# EAGLE design DCCGen_ATMEGA_V2_Haka (EAGLE 5.11)
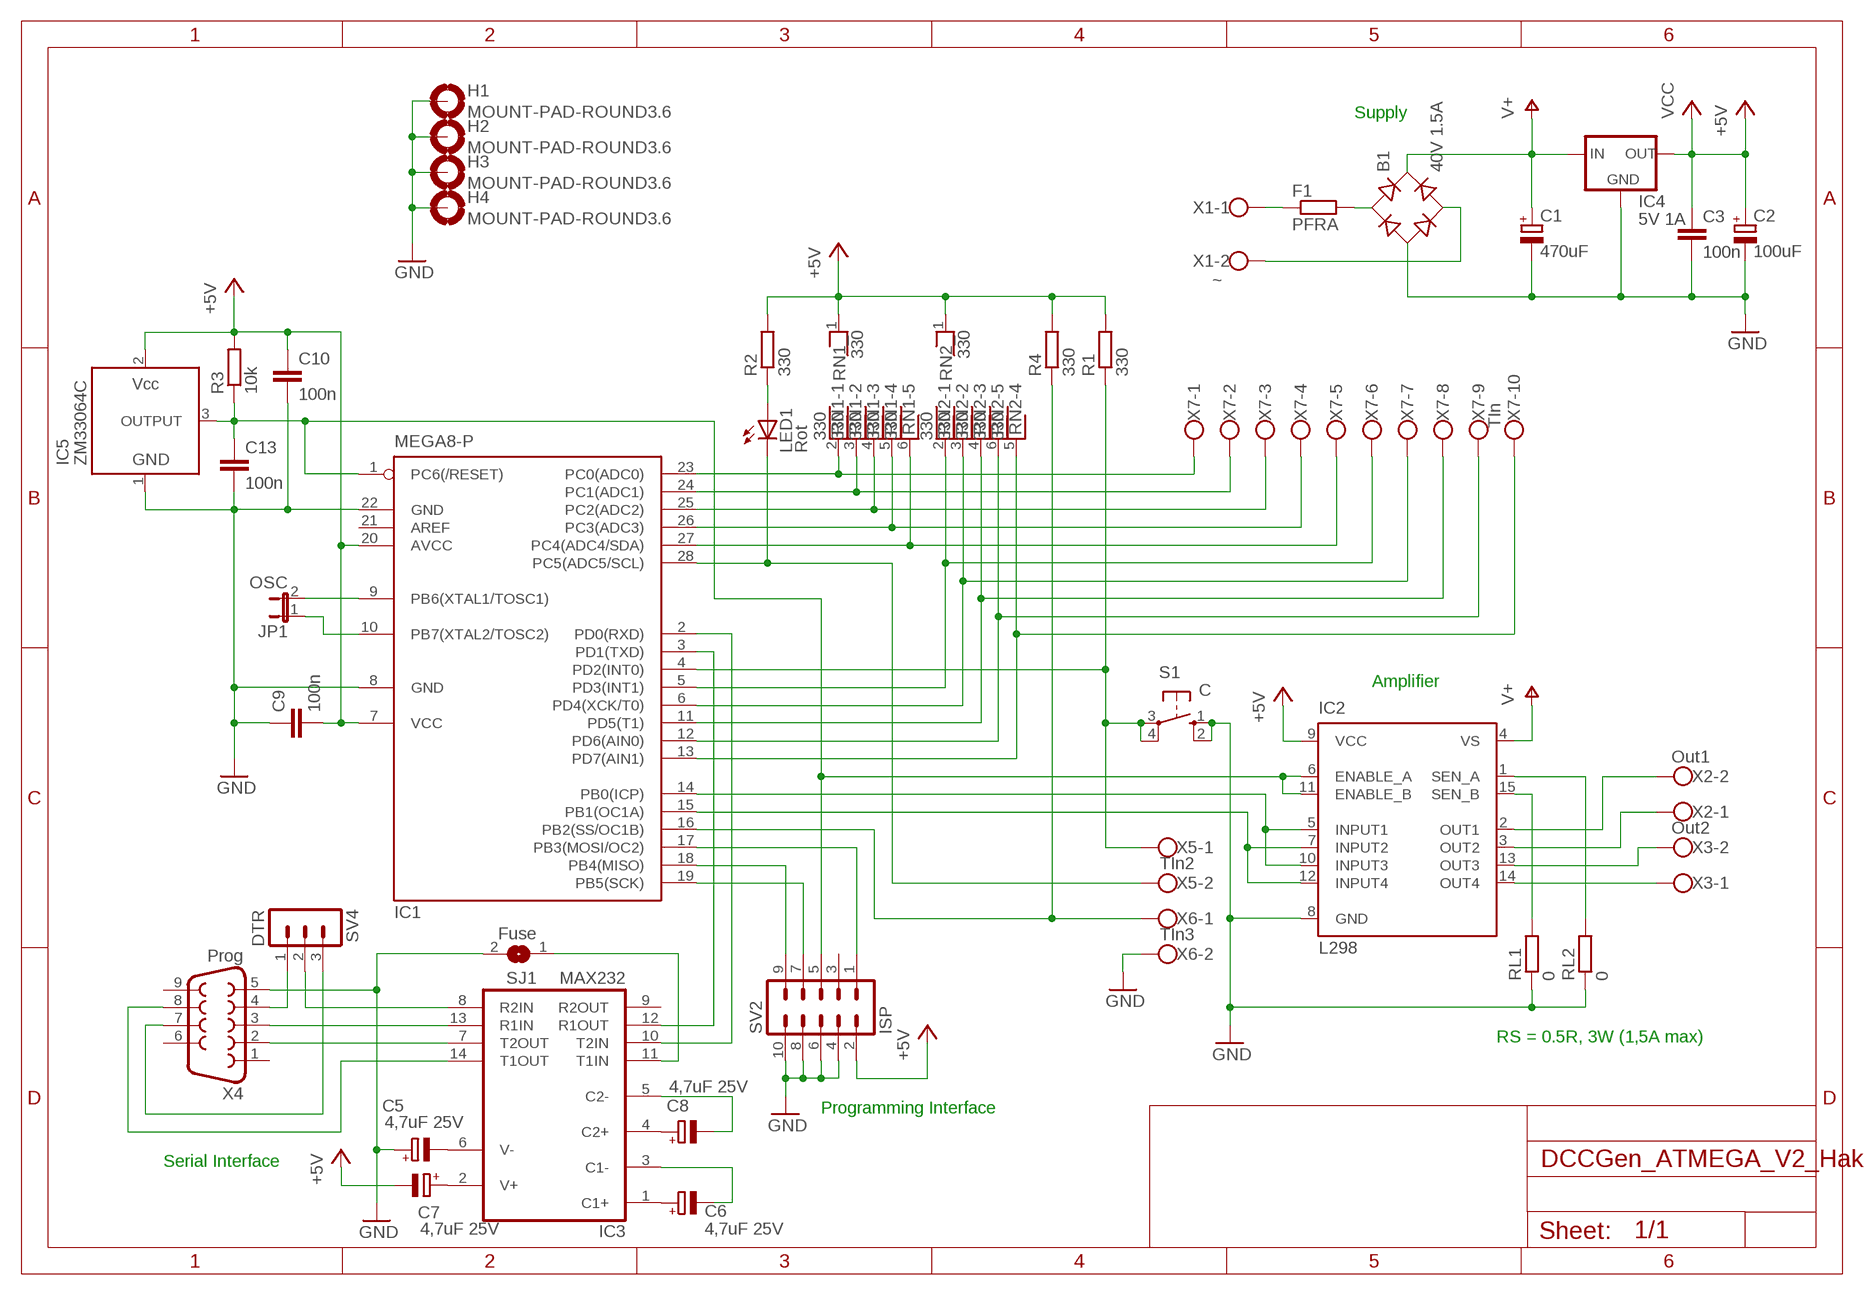
[diagram p0: schematic, sheet 1]

## Parts
B1  40V 1.5A  RB1A  [RB1A]
C1  470uF  CPOL-EUE3.5-10  [E3,5-10]
C2  100uF  CPOL-EUE2-5  [E2-5]
C3  100n  C-EU025-025X050  [C025-025X050]
C5  4,7uF 25V  CPOL-EUE2,5-6E  [E2,5-6E]
C6  4,7uF 25V  CPOL-EUE2,5-6E  [E2,5-6E]
C7  4,7uF 25V  CPOL-EUE2,5-6E  [E2,5-6E]
C8  4,7uF 25V  CPOL-EUE2,5-6E  [E2,5-6E]
C9  100n  C-EU025-025X050  [C025-025X050]
C10  100n  C-EU025-025X050  [C025-025X050]
C13  100n  C-EU025-025X050  [C025-025X050]
F1  PFRA  R-EU_0204/5  [0204/5]
H1  MOUNT-PAD-ROUND3.6  [3,6-PAD]
H2  MOUNT-PAD-ROUND3.6  [3,6-PAD]
H3  MOUNT-PAD-ROUND3.6  [3,6-PAD]
H4  MOUNT-PAD-ROUND3.6  [3,6-PAD]
IC1  MEGA8-P  [DIL28-3]
IC2  L298  [MULTIWATT-15]
IC3  MAX232  [DIL16]
IC4  5V 1A  78XXS  [78XXS]
IC5  ZM33064C  [TO92]
JP1  OSC  JP1E  [JP1]
LED1  Rot  LED3MM  [LED3MM]
R1  330  R-EU_0207/10  [0207/10]
R2  330  R-EU_0207/10  [0207/10]
R3  10k  R-EU_0207/10  [0207/10]
R4  330  R-EU_0207/10  [0207/10]
RL1  0  R-EU_0207/10  [0207/10]
RL2  0  R-EU_0207/10  [0207/10]
RN1  330  RNX5  [RN-6]
RN2  330  RNX5  [RN-6]
S1  C  10-XX  [B3F-10XX]
SJ1  Fuse  SJ  [SJ]
SV2  ISP  MA05-2  [MA05-2]
SV4  DTR  MA03-1  [MA03-1]
X1  ~  W237-02P  [W237-132]
X2  Out1  W237-02P  [W237-132]
X3  Out2  W237-02P  [W237-132]
X4  Prog  F09HP  [F09HP]
X5  TIn2  W237-02P  [W237-132]
X6  TIn3  W237-02P  [W237-132]
X7  TIn  W237-10P  [W237-10P]

## Nets
+5V: C2.+ C3.1 C7.- C9.2 C10.1 IC1.7(VCC) IC1.20(AVCC) IC2.9(VCC) IC4.OUT IC5.2(VCC) R1.2 R2.2 R3.2 R4.2 RN1.1 RN2.1 SV2.2 ; supply symbol labelled VCC
GND: B1.- C1.- C2.- C3.2 C5.+ C9.1 C10.2 C13.2 H1.B3,6(MOUNT) H2.B3,6(MOUNT) H3.B3,6(MOUNT) H4.B3,6(MOUNT) IC1.8(GND) IC1.22(GND) IC2.8(GND) IC4.GND IC5.1(GND) RL1.1 RL2.1 S1.1(S) S1.2(S1) SJ1.2 SV2.4 SV2.6 SV2.8 SV2.10 X4.5 X6.2
N$1: F1.1 X1.1
N$2: B1.AC2 X1.2
N$3: IC1.13(PD7(AIN1)) RN2.5 X7.10
N$4: IC1.12(PD6(AIN0)) RN2.6 X7.9
N$5: IC1.23(PC0(ADC0)) RN1.2 X7.1
N$6: IC1.17(PB3(MOSI/OC2)) SV2.1
N$7: IC1.19(PB5(SCK)) SV2.7
N$8: IC1.18(PB4(MISO)) SV2.9
N$9: C13.1 IC1.1(PC6(/RESET)) IC2.6(ENABLE_A) IC2.11(ENABLE_B) IC5.3(OUTPUT) R3.1 SV2.5
N$10: IC1.24(PC1(ADC1)) RN1.3 X7.2
N$11: IC1.25(PC2(ADC2)) RN1.4 X7.3
N$12: IC1.26(PC3(ADC3)) RN1.5 X7.4
N$13: IC1.27(PC4(ADC4/SDA)) RN1.6 X7.5
N$14: IC1.5(PD3(INT1)) RN2.2 X7.6
N$15: IC1.9(PB6(XTAL1/TOSC1)) JP1.2
N$16: IC1.10(PB7(XTAL2/TOSC2)) JP1.1
N$17: LED1.A R2.1
N$19: IC1.6(PD4(XCK/T0)) RN2.3 X7.7
N$20: IC1.4(PD2(INT0)) R1.1 S1.3(P) S1.4(P1) X5.1
N$21: IC3.8(R2IN) SV4.2
N$22: IC2.14(OUT4) X3.1
N$23: IC1.28(PC5(ADC5/SCL)) LED1.K(C) X5.2
N$24: IC2.1(SEN_A) RL2.2
N$25: IC2.13(OUT3) X3.2
N$26: IC2.15(SEN_B) RL1.2
N$27: IC1.14(PB0(ICP)) IC2.5(INPUT1) IC2.10(INPUT3)
N$28: IC1.15(PB1(OC1A)) IC2.7(INPUT2) IC2.12(INPUT4)
N$29: IC2.3(OUT2) X2.1
N$30: IC2.2(OUT1) X2.2
N$31: IC1.2(PD0(RXD)) IC3.10(T2IN)
N$32: IC1.3(PD1(TXD)) IC3.12(R1OUT)
N$33: C5.- IC3.6(V-)
N$34: C7.+ IC3.2(V+)
N$35: IC3.7(T2OUT) X4.2
N$36: C6.+ IC3.1(C1+)
N$37: C6.- IC3.3(C1-)
N$38: C8.+ IC3.4(C2+)
N$39: C8.- IC3.5(C2-)
N$40: IC3.13(R1IN) X4.3
N$41: IC3.14(T1OUT) X4.8
N$42: SV4.1 X4.4
N$43: B1.AC1 F1.2
N$44: SV4.3 X4.7
N$45: IC1.16(PB2(SS/OC1B)) R4.1 X6.1
N$46: IC3.11(T1IN) SJ1.1
N$47: IC1.11(PD5(T1)) RN2.4 X7.8
V+: B1.+ C1.+ IC2.4(VS) IC4.IN
Unconnected: IC1.21(AREF) IC3.9(R2OUT) SV2.3 X4.1 X4.6 X4.9

## Notes on the sheet
- Supply
- Amplifier
- RS = 0.5R, 3W (1,5A max)
- Programming Interface
- Serial Interface

## Power pins joined to a net without a drawn wire
+5V: IC3.16(VCC)
GND: IC3.15(GND)

## Library data of the parts
B1 = rectifier:RB1A: RECTIFIER 1 A
C1 C2 C5-C8 = rcl:CPOL-EU: POLARIZED CAPACITOR, European symbol
C3 C9 C10 C13 = rcl:C-EU: CAPACITOR, European symbol
F1 R1-R4 RL1 RL2 = rcl:R-EU_: RESISTOR, European symbol
H1-H4 = holes:MOUNT-PAD-ROUND: MOUNTING PAD, round
IC1 = atmel:MEGA8-P: MICROCONTROLLER 8 Kbytes FLASH, 1 kbytes SRAM, 512 bytes EEPROM, USART, 4-channel 10 bit ADC, 2-channel 8 bit ADC Pin compatible with Atmega48, ATMega88, ATMega168 Source: avr.lbr
IC2 = st-microelectronics:L298: DUAL FULL-BRIDGE DRIVER
IC3 = maxim:MAX232: RS232 TRANSEIVER
IC4 = v-reg:78XXS: VOLTAGE REGULATOR
IC5 = andereBauteile:ZM33064: ZM33064 Resetbautstein Schaltschwelle bei 4,6 Volt
JP1 = jumper:JP1E: JUMPER
LED1 = led:LED: LED OSRAM: - CHIPLED LG R971, LG N971, LY N971, LG Q971, LY Q971, LO R971, LY R971 LH N974, LH R974 LS Q976, LO Q976, LY Q976 LO Q996 - Hyper CHIPLED LW Q18S LB Q993, LB Q99A, LB R99A - SideLED LS A670, LO A670, LY A670, LG A670, LP A670 LB A673, LV A673, LT A673, LW A673 LH A674 LY A675 LS A676, LA A676, LO A676, LY A676, LW A676 LS A679, LY A679, LG A679 - Hyper Micro SIDELED® LS Y876, LA Y876, LO Y876, LY Y876 LT Y87S - SmartLED LW L88C, LW L88S LB L89C, LB L89S, LG L890 LS L89K, LO L89K, LY L89K LS L896, LA L896, LO L896, LY L896 - TOPLED LS T670, LO T670, LY T670, LG T670, LP T670 LSG T670, LSP T670, LSY T670, LOP T670, LYG T670 LG T671, LOG T671, LSG T671 LB T673, LV T673, LT T673, LW T673 LH T674 LS T676, LA T676, LO T676, LY T676, LB T676, LH T676, LSB T676, LW T676 LB T67C, LV T67C, LT T67C, LS T67K, LO T67K, LY T67K, LW E67C LS E67B, LA E67B, LO E67B, LY E67B, LB E67C, LV E67C, LT E67C LW T67C LS T679, LY T679, LG T679 LS T770, LO T770, LY T770, LG T770, LP T770 LB T773, LV T773, LT T773, LW T773 LH T774 LS E675, LA E675, LY E675, LS T675 LS T776, LA T776, LO T776, LY T776, LB T776 LHGB T686 LT T68C, LB T68C - Hyper Mini TOPLED® LB M676 - Mini TOPLED Santana® LG M470 LS M47K, LO M47K, LY M47K Source: http://www.osram.convergy.de LUXEON: - LUMILED® LXK2-PW12-R00, LXK2-PW12-S00, LXK2-PW14-U00, LXK2-PW14-V00 LXK2-PM12-R00, LXK2-PM12-S00, LXK2-PM14-U00 LXK2-PE12-Q00, LXK2-PE12-R00, LXK2-PE12-S00, LXK2-PE14-T00, LXK2-PE14-U00 LXK2-PB12-K00, LXK2-PB12-L00, LXK2-PB12-M00, LXK2-PB14-N00, LXK2-PB14-P00, LXK2-PB14-Q00 LXK2-PR12-L00, LXK2-PR12-M00, LXK2-PR14-Q00, LXK2-PR14-R00 LXK2-PD12-Q00, LXK2-PD12-R00, LXK2-PD12-S00 LXK2-PH12-R00, LXK2-PH12-S00 LXK2-PL12-P00, LXK2-PL12-Q00, LXK2-PL12-R00 Source: www.luxeon.com KINGBRIGHT: KA-3528ASYC Source: www.kingbright.com
RN1 RN2 = resistor-net:RNX5: RESISTOR NETWORK
S1 = switch-omron:10-XX: OMRON SWITCH
SJ1 = jumper:SJ: SMD solder JUMPER
SV2 = con-lstb:MA05-2: PIN HEADER
SV4 = con-lstb:MA03-1: PIN HEADER
X1-X3 X5 X6 = con-wago-508:W237-02P: WAGO SREW CLAMP
X4 = con-subd:F09: SUB-D; OC_FARNELL: unknown; OC_NEWARK: unknown
X7 = con-wago-508:W237-10P: WAGO SREW CLAMP

## Board
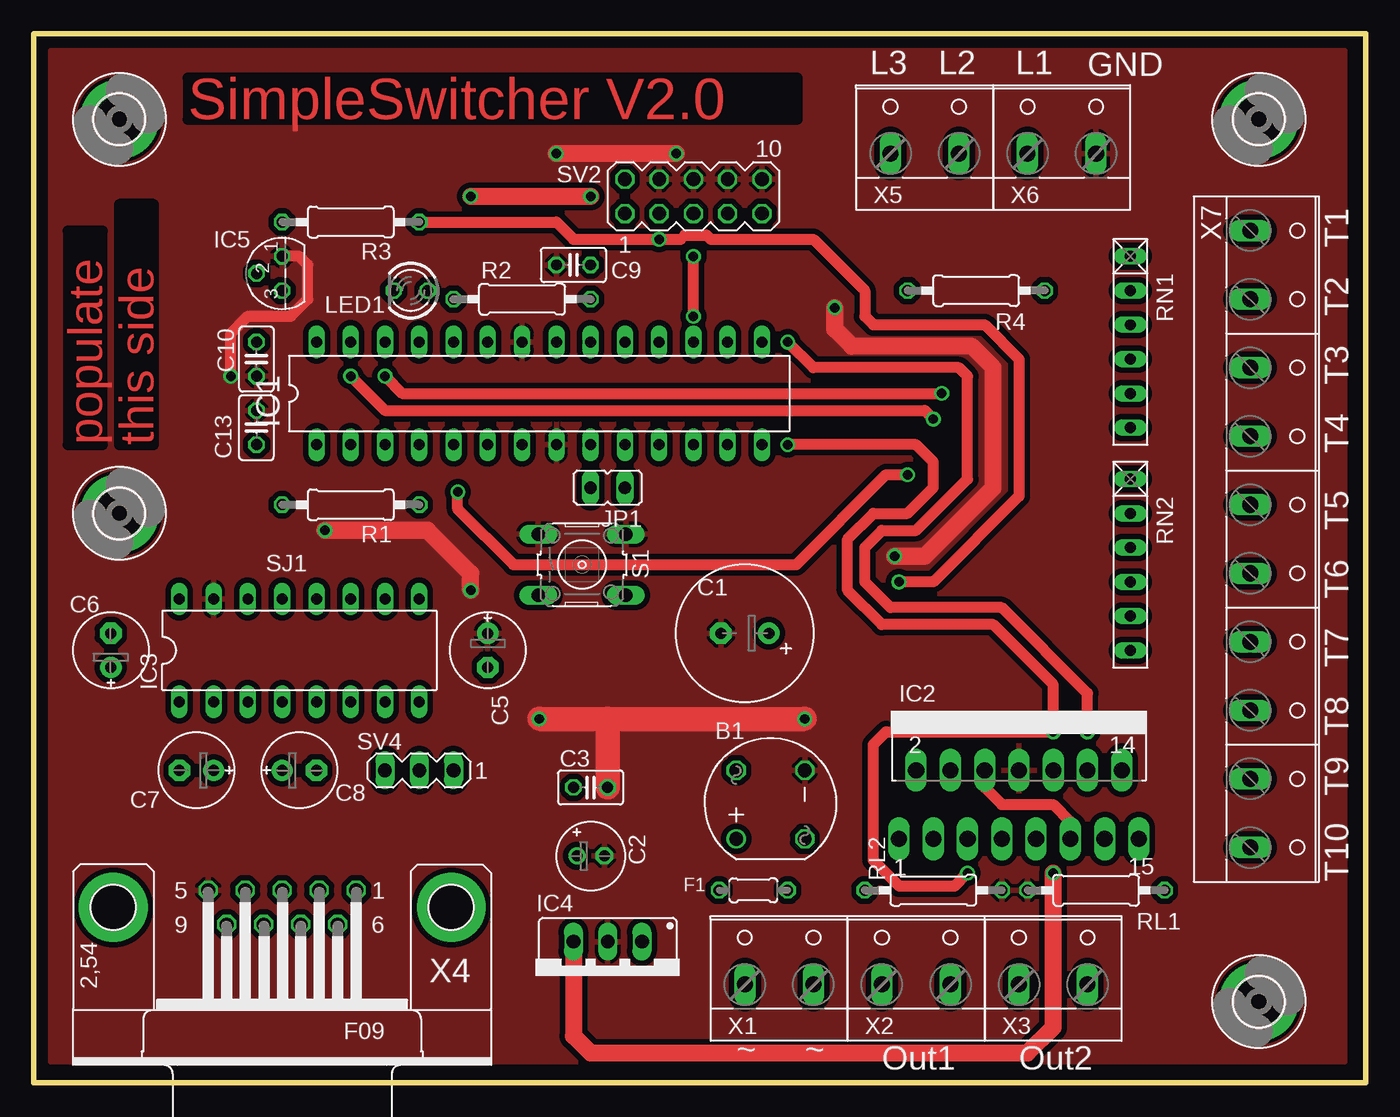
[diagram p1: board, top side]
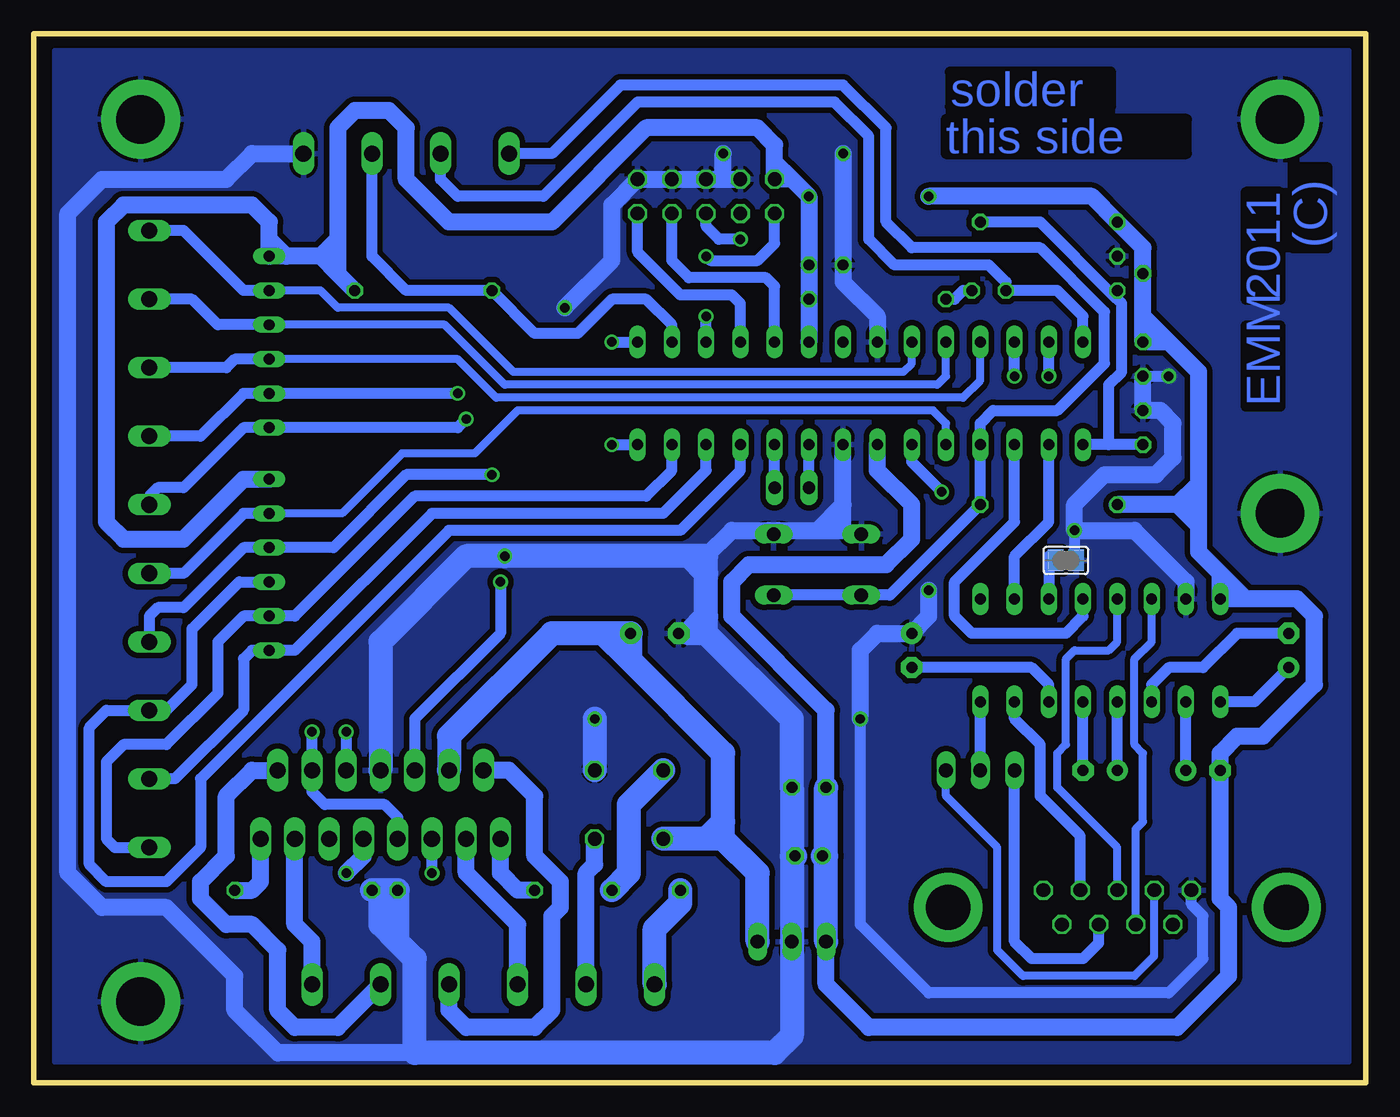
[diagram p2: board, bottom side, seen from below]

Size 98.73 x 77.78 mm. Coordinates in mm from the lower left corner, seen from the top.
Outline: 0,0 98.73,0 98.73,77.78 0,77.78 0,0
Copper layers (1*16): Top 0.035mm / dielectric 1.5mm / Bottom 0.035mm
Design rules "HAKA LP ZWILLING": minimum track width 0.2mm, minimum drill 0.5mm, track to track 0.2mm, track to pad 0.2mm, pad to pad 0.15mm, via to via 0.2mm, smd to smd 0mil, copper to edge 0.2mm, drill to drill 0.2mm, minimum pad ring 0.2mm, minimum via ring 0.2mm, stop-mask expansion 0.1mm, vias tented up to drill 0mil, thermal gap 10mil

### Footprints (pad centres in the part's own frame; a part is rotated, then mirrored left to right if it is on the bottom)
RB1A = drill 1.016 round: + -2.54,2.54 | drill 1.016 octagon: - 2.54,-2.54; AC1 2.54,2.54; AC2 -2.54,-2.54
E3,5-10 = drill 0.813 pad 1.6 round: + -1.778,0 | drill 0.813 pad 1.6 octagon: - 1.778,0
E2-5 = drill 0.813 pad 1.27 round: + -1.016,0 | drill 0.813 pad 1.27 octagon: - 1.016,0
C025-025X050 = drill 0.813 octagon: 1 -1.27,0; 2 1.27,0
E2,5-6E = drill 0.813 pad 1.575 round: + -1.27,0 | drill 0.813 pad 1.575 octagon: - 1.27,0
0204/5 = drill 0.813 octagon: 1 -2.54,0; 2 2.54,0
3,6-PAD = drill 3.6 pad 5.842 round: B3,6 0,0
DIL28-3 = drill 0.813 long: 1 -16.51,-3.81; 2 -13.97,-3.81; 3 -11.43,-3.81; 4 -8.89,-3.81; 5 -6.35,-3.81; 6 -3.81,-3.81; 7 -1.27,-3.81; 8 1.27,-3.81; 9 3.81,-3.81; 10 6.35,-3.81; 11 8.89,-3.81; 12 11.43,-3.81; 13 13.97,-3.81; 14 16.51,-3.81; 15 16.51,3.81; 16 13.97,3.81; 17 11.43,3.81; 18 8.89,3.81; 19 6.35,3.81; 20 3.81,3.81; 21 1.27,3.81; 22 -1.27,3.81; 23 -3.81,3.81; 24 -6.35,3.81; 25 -8.89,3.81; 26 -11.43,3.81; 27 -13.97,3.81; 28 -16.51,3.81
MULTIWATT-15 = drill 1.2 long: 1 -8.89,-7.62; 2 -7.62,-2.54; 3 -6.35,-7.62; 4 -5.08,-2.54; 5 -3.81,-7.62; 6 -2.54,-2.54; 7 -1.27,-7.62; 8 0,-2.54; 9 1.27,-7.62; 10 2.54,-2.54; 11 3.81,-7.62; 12 5.08,-2.54; 13 6.35,-7.62; 14 7.62,-2.54; 15 8.89,-7.62
DIL16 = drill 0.813 long: 1 -8.89,-3.81; 2 -6.35,-3.81; 3 -3.81,-3.81; 4 -1.27,-3.81; 5 1.27,-3.81; 6 3.81,-3.81; 7 6.35,-3.81; 8 8.89,-3.81; 9 8.89,3.81; 10 6.35,3.81; 11 3.81,3.81; 12 1.27,3.81; 13 -1.27,3.81; 14 -3.81,3.81; 15 -6.35,3.81; 16 -8.89,3.81
78XXS = drill 1.016 long: GND 0,-2.54; IN -2.54,-2.54; OUT 2.54,-2.54
TO92 = drill 0.813 octagon: 1 1.27,0; 2 0,1.905; 3 -1.27,0
JP1 = drill 0.914 long: 1 0,-1.27; 2 0,1.27
LED3MM = drill 0.813 octagon: A -1.27,0; K 1.27,0
0207/10 = drill 0.813 octagon: 1 -5.08,0; 2 5.08,0
RN-6 = drill 0.813 long: 1 -6.35,0; 2 -3.81,0; 3 -1.27,0; 4 1.27,0; 5 3.81,0; 6 6.35,0
B3F-10XX = drill 1.016 long: 1 -3.251,2.261; 2 3.251,2.261; 3 -3.251,-2.261; 4 3.251,-2.261
SJ = smd 1.168 x 1.6: 1 -0.762,0; 2 0.762,0
MA05-2 = drill 1.016 octagon: 1 -5.08,-1.27; 2 -5.08,1.27; 3 -2.54,-1.27; 4 -2.54,1.27; 5 0,-1.27; 6 0,1.27; 7 2.54,-1.27; 8 2.54,1.27; 9 5.08,-1.27; 10 5.08,1.27
MA03-1 = drill 1.016 long: 1 -2.54,0; 2 0,0; 3 2.54,0
W237-132 = drill 1.194 long: 1 -2.54,-0.635; 2 2.54,-0.635
F09HP = drill 1.016 octagon: 1 -5.486,-1.27; 2 -2.743,-1.27; 3 0,-1.27; 4 2.743,-1.27; 5 5.486,-1.27; 6 -4.115,1.27; 7 -1.372,1.27; 8 1.372,1.27; 9 4.115,1.27 | drill 3.302 pad 5.08 round: G1 -12.522,0; G2 12.522,0
W237-10P = drill 1.194 long: 1 -22.86,-0.635; 2 -17.78,-0.635; 3 -12.7,-0.635; 4 -7.62,-0.635; 5 -2.54,-0.635; 6 2.54,-0.635; 7 7.62,-0.635; 8 12.7,-0.635; 9 17.78,-0.635; 10 22.86,-0.635

### Placement (x,y rotation side)
B1  54.61,20.64 90 top
C1  52.7,33.34 180 top
C2  41.27,16.83 0 top
C3  41.27,21.91 0 top
C5  33.66,32.07 270 top
C6  5.71,32.07 90 top
C7  12.07,23.18 180 top
C8  19.68,23.18 0 top
C9  40,60.64 0 top
C10  16.51,53.66 270 top
C13  16.51,48.58 90 top
F1  53.34,14.29 0 top
H1  6.35,71.44 0 top
H2  6.35,42.23 0 top
H3  90.8,71.44 0 top
H4  90.8,6.03 0 top
IC1  37.46,51.12 0 top
IC2  73.03,25.72 0 top
IC3  19.68,32.07 0 top
IC4  42.55,7.94 180 top
IC5  18.41,60.01 90 top
JP1  42.55,44.13 90 top
LED1  27.94,58.74 180 top
R1  23.49,42.86 180 top
R2  36.2,58.1 0 top
R3  23.49,63.82 180 top
R4  69.85,58.74 0 top
RL1  78.74,14.29 0 top
RL2  66.67,14.29 180 top
RN1  81.28,54.93 270 top
RN2  81.28,38.42 270 top
S1  40.64,38.42 0 top
SJ1  22.22,38.73 0 bottom
SV2  48.89,65.72 0 top
SV4  28.57,23.18 180 top
X1  55.24,7.94 0 top
X2  65.41,7.94 0 top
X3  75.56,7.94 0 top
X4  18.41,13.02 180 top
X5  66.04,69.53 0 top
X6  76.2,69.53 0 top
X7  90.8,40.32 270 top

### Tracks (layer width: path | path; a pad name or v marks a point on that pad's centre or on a via)
+5V  (via drill 0.7)
  Top 1.27: v32.38,65.72 v41.27,65.72 | v75.56,15.56 75.56,4.13 73.66,2.22 41.27,2.22 40,3.49 IC4.OUT
  Bottom 1.27: 10.79,37.78 IC3.16 8.89,35.88 | 12.38,41.27 12.38,42.86 | 12.38,42.86 13.97,42.86 | 13.97,42.86 R1.2 | 8.89,35.88 5.08,35.88 3.81,34.61 3.81,29.53 7.62,25.72 9.53,25.72 10.79,24.45 C7.- 10.79,13.65 10.16,13.02 10.16,7.94 13.97,4.13 36.83,4.13 40,7.3 IC4.OUT | 12.38,42.86 12.38,44.45 | 14.61,54.93 C10.1 16.51,56.83 | 42.55,66.99 SV2.2 43.81,68.26 | 42.55,66.99 v41.27,65.72 C9.2 R2.2 IC1.20 | 43.81,68.26 43.81,69.53 45.09,70.8 53.34,70.8 60.32,63.82 67.94,63.82 71.12,66.99 71.12,70.8 72.39,72.07 74.93,72.07 76.2,70.8 76.2,62.55 | v32.38,65.72 20.32,65.72 R3.2 16.51,61.91 IC5.2 16.51,56.83 | IC1.7 36.2,45.4 33.66,42.86 33.66,40.32 35.56,38.42 45.72,38.42 46.99,37.15 46.99,34.61 40,27.62 C3.1 | IC2.9 74.3,16.83 v75.56,15.56 | 76.2,62.55 76.2,61.28 | 76.2,61.28 76.2,60.01 | 76.2,60.01 R4.2 | 13.97,42.86 12.38,44.45 | 12.38,41.27 13.97,42.86 | 14.61,54.93 16.51,56.83 | 12.38,44.45 12.38,52.7 14.61,54.93 | 8.89,35.88 10.79,37.78 | 12.38,41.27 12.38,39.37 10.79,37.78 | RN2.1 83.19,44.77 87.63,40.32 92.08,40.32 93.34,41.59 93.34,63.82 92.08,65.09 82.55,65.09 81.28,63.82 81.28,62.55 | 81.28,62.55 RN1.1 80.01,61.28 | 76.2,61.28 77.47,61.28 | 77.47,61.28 80.01,61.28 | 42.55,66.99 43.81,68.26 | 76.2,62.55 77.47,61.28 | 77.47,61.28 76.2,60.01 | 80.01,61.28 81.28,62.55
  Bottom 1.778: IC4.OUT 40,16.83 | 40,16.83 C3.1 | 40,16.83 C2.+
GND  (via drill 0.7)
  Top 0.813: IC5.1 19.68,61.28 20.32,60.64 20.32,58.1 19.05,56.83 15.88,56.83 14.61,55.56 v14.61,52.39
  Top 1.27: v32.38,36.51 32.38,37.78 29.21,40.96 v21.59,40.96 | v47.62,68.9 v38.73,68.9 | v63.82,39.05 66.04,39.05 71.12,44.13 71.12,53.02 69.53,54.61 60.64,54.61 59.37,55.88 v59.37,57.47
  Top 1.778: 42.55,26.99 v57.15,26.99 | v37.46,26.99 42.55,26.99 | 42.55,26.99 C3.2
  Bottom 0.813: X4.5 12.93,13.25 12.07,12.38 12.07,9.21 14.61,6.67 32.38,6.67 37.46,11.75 v37.46,26.99 | 38.73,40.96 37.67,40.96 S1.1 | 44.25,40.96 S1.2 | S1.2 43.46,40.68 | S1.2 43.54,40.96 | v21.59,40.96 21.59,39.18 SJ1.2 | C10.2 v14.61,52.39
  Bottom 1.27: 47.62,66.99 SV2.6 SV2.8 SV2.10 55.88,65.09 55.88,60.96 v59.37,57.47 | C10.2 C13.2 15.24,49.85 14.29,48.9 14.29,46.36 15.56,45.08 19.37,45.08 21.59,42.86 v21.59,40.96 17.14,40.96 13.34,37.15 IC3.15 | IC1.22 36.2,56.83 38.73,59.37 C9.1 v38.73,68.9 | 47.62,66.99 SV2.4 | 47.62,66.99 v47.62,68.9 | X6.2 82.55,68.9 84.45,66.99 93.66,66.99 96.2,64.45 96.2,15.56 93.66,13.02 88.9,13.02 83.82,7.94 83.82,5.4 80.64,2.22 70.48,2.22 | 38.73,42.86 38.73,40.96 40.64,40.96 | 38.73,42.86 IC1.8 | 40.64,40.96 43.54,40.96 44.25,40.96 46.99,40.96 48.89,39.05 | 50.16,33.34 C1.- | v32.38,36.51 32.38,34.61 C5.+ 36.2,33.34 37.46,32.07 v37.46,26.99 | 40.64,40.96 38.73,42.86
  Bottom 1.778: 73.03,14.29 RL1.1 | 73.03,14.29 73.03,11.75 71.75,10.48 | IC2.8 73.03,32.7 66.67,39.05 v63.82,39.05 50.16,39.05 | v57.15,26.99 B1.- | 48.89,33.34 50.16,33.34 48.89,34.61 | 48.89,33.34 42.55,26.99 C3.2 42.55,16.83 | 48.89,33.34 48.89,34.61 | 48.89,34.61 48.89,37.78 | 48.89,37.78 48.89,39.05 50.16,39.05 | 73.03,14.29 RL2.1 71.75,10.48 | 71.75,10.48 70.48,9.21 70.48,2.22 43.81,2.22 42.55,3.49 IC4.GND 42.55,16.83 | 48.89,37.78 50.16,39.05 | 42.55,16.83 C2.-
  pour Bottom (isolate 0.406): 1.27,76.52 97.16,76.52 97.16,1.59 1.27,1.59
  pour Top (isolate 0.406): 1.27,76.52 97.16,76.52 97.16,1.59 1.27,1.59
N$1
  Bottom 1.778: X1.1 52.7,11.43 50.8,13.33 F1.1
N$2
  Bottom 1.27: X1.2 57.78,15.56 57.15,16.19 B1.AC2
N$3
  Bottom 0.813: IC1.13 51.44,45.4 53.34,43.5 70.48,43.5 79.38,34.61 RN2.5 83.19,34.61 85.09,32.7 85.09,28.89 88.9,25.08 92.08,25.08 93.34,23.81 93.34,18.1 92.71,17.46 X7.10
N$4
  Bottom 0.813: IC1.12 48.89,45.4 52.07,42.23 69.22,42.23 79.38,32.07 RN2.6 82.55,32.07 83.19,31.43 83.19,27.62 88.27,22.54 X7.9
N$5
  Bottom 0.61: IC1.23 33.66,53.34 34.29,52.7 63.18,52.7 67.94,57.47 76.2,57.47 77.47,58.74 RN1.2
  Bottom 0.813: RN1.2 83.19,58.74 87.63,63.18 X7.1
N$6  (via drill 0.7)
  Top 0.813: v48.89,56.83 v48.89,61.28
  Bottom 0.813: v48.89,61.28 48.58,60.96 45.09,60.96 43.81,62.23 SV2.1 | IC1.17 v48.89,56.83
N$7
  Bottom 0.813: IC1.19 43.81,59.05 44.45,59.69 50.16,59.69 51.44,60.96 SV2.7
N$8
  Bottom 0.813: IC1.18 46.35,57.79 46.99,58.42 50.8,58.42 53.98,61.59 SV2.9
N$9  (via drill 0.7)
  Top 0.813: v64.14,37.15 66.67,37.15 73.03,43.5 73.03,53.66 70.48,56.2 62.23,56.2 61.59,56.83 61.59,58.74 57.78,62.55 50.16,62.55 49.85,62.87 48.26,62.87 47.94,62.55 v46.35,62.55 40,62.55 38.73,63.82 R3.1 | IC2.6 70.48,21.91 71.75,20.64 75.56,20.64 76.83,19.37 IC2.11
  Bottom 0.813: v46.35,62.55 47.94,62.55 48.89,63.5 SV2.5 | 18.73,58.42 24.13,63.82 R3.1 | C13.1 19.05,47.31 | 19.05,47.31 19.05,51.75 18.1,52.7 18.1,57.79 18.73,58.42 | v64.14,37.15 64.14,33.34 70.48,26.99 IC2.6 | 19.05,47.31 IC1.1 | 18.73,58.42 IC5.3
N$10
  Bottom 0.61: IC1.24 31.12,52.39 31.75,51.75 63.82,51.75 68.26,56.2 RN1.3
  Bottom 0.813: X7.2 87,58.1 85.09,56.2 RN1.3
N$11
  Bottom 0.61: IC1.25 28.57,52.07 29.84,50.8 64.45,50.8 67.31,53.66 RN1.4
  Bottom 0.813: X7.3 84.45,53.02 83.82,53.66 RN1.4
N$12  (via drill 0.7)
  Top 0.813: v67.31,51.12 27.3,51.12 v26.04,52.39
  Bottom 0.813: v26.04,52.39 IC1.26 | X7.4 86.36,47.94 83.19,51.12 RN1.5 v67.31,51.12
N$13  (via drill 0.7)
  Top 0.813: v66.67,49.21 66.04,49.85 26.04,49.85 v23.49,52.39
  Bottom 0.813: v66.67,49.21 67.31,48.58 RN1.6 83.19,48.58 87.63,44.13 89.53,44.13 90.17,43.5 X7.5 | v23.49,52.39 IC1.27
N$14
  Bottom 0.61: IC1.5 31.12,48.9 32.07,49.85 62.86,49.85 66.04,46.67 71.44,46.67 75.88,42.23 RN2.2
  Bottom 0.813: X7.6 87.63,37.78 83.19,42.23 RN2.2
N$15
  Bottom 0.813: JP1.2 IC1.9
N$16
  Bottom 0.813: JP1.1 IC1.10
N$17
  Bottom 0.813: LED1.A 29.84,58.74 30.48,58.1 R2.1
N$19  (via drill 0.7)
  Top 0.813: v31.43,43.82 31.43,42.55 35.56,38.42 56.52,38.42 63.18,45.08 v64.77,45.08
  Bottom 0.813: X7.7 90.17,34.61 89.53,35.24 87.63,35.24 83.19,39.69 RN2.3 76.52,39.69 71.12,45.08 v64.77,45.08 | IC1.6 33.66,46.04 v31.43,43.82
N$20
  Bottom 0.813: S1.4 S1.3 35.28,36.16 R1.1 IC1.4 28.57,48.9 27.62,49.85 22.86,49.85 19.37,53.34 19.37,57.15 24.13,61.91 33.66,61.91 35.56,63.82 35.56,70.8 38.73,73.98 55.24,73.98 60.32,68.9 X5.1
N$21
  Bottom 0.813: SV4.2 IC3.8
N$22
  Bottom 1.27: IC2.14 82.55,23.18 84.45,21.27 84.45,16.83 86.36,14.92 86.36,13.65 84.45,11.75 82.55,11.75 80.64,9.84 80.64,5.4 79.38,4.13 76.2,4.13 X3.1
N$23
  Bottom 0.813: X5.2 68.58,66.99 67.31,65.72 60.96,65.72 53.98,72.71 39.37,72.71 36.83,70.17 36.83,62.55 34.92,60.64 27.94,60.64 26.67,59.37 LED1.K 22.86,58.74 20.95,56.83 IC1.28
N$24
  Bottom 1.27: IC2.1 64.14,15.56 62.86,14.29 RL2.2
N$25
  Bottom 1.27: IC2.13 79.38,11.75 78.11,10.48 X3.2
N$26
  Bottom 1.27: IC2.15 81.91,14.92 82.55,14.29 RL1.2
N$27  (via drill 0.7)
  Top 0.813: v55.88,47.31 65.41,47.31 66.67,46.04 66.67,44.13 64.77,42.23 62.23,42.23 60.32,40.32 60.32,36.51 62.86,33.97 71.12,33.97 75.56,29.53 v75.56,26.03 63.18,26.03 62.23,25.08 62.23,16.51 64.14,14.61 68.26,14.61 v69.22,15.56
  Bottom 0.813: v55.88,47.31 IC1.14 | v75.56,26.03 IC2.10 | v69.22,15.56 IC2.5
N$28  (via drill 0.7)
  Top 0.813: v55.88,54.93 57.78,53.02 68.58,53.02 69.22,52.39 69.22,44.77 65.41,40.96 62.86,40.96 61.59,39.69 61.59,37.15 63.5,35.24 71.75,35.24 78.11,28.89 v78.11,26.03
  Bottom 0.813: IC2.7 71.75,19.69 72.71,20.64 77.15,20.64 78.11,21.59 IC2.12 v78.11,26.03 | v55.88,54.93 IC1.15
N$29
  Bottom 1.27: IC2.3 66.67,15.56 62.86,11.75 X2.1
N$30
  Bottom 1.27: X2.2 67.94,5.4 66.67,4.13 61.59,4.13 60.32,5.4 60.32,12.38 59.69,13.02 59.69,14.92 61.59,16.83 61.59,21.27 63.5,23.18 IC2.2
N$31
  Bottom 0.813: IC3.10 26.04,39.05 23.49,41.59 IC1.2
N$32
  Bottom 0.813: IC3.12 20.95,34.61 22.22,33.34 29.21,33.34 30.48,34.61 30.48,37.15 26.04,41.59 IC1.3
N$33
  Bottom 0.813: IC3.6 23.49,29.53 24.77,30.8 C5.-
N$34
  Bottom 0.813: C7.+ IC3.2
N$35
  Bottom 0.813: X4.2 21.16,18.3 24.13,21.27 24.13,25.08 26.04,26.99 IC3.7
N$36
  Bottom 0.813: C6.+ 8.26,28.26 IC3.1
N$37
  Bottom 0.813: C6.- 9.53,33.34 12.07,30.8 14.61,30.8 15.88,29.53 IC3.3
N$38
  Bottom 0.813: C8.+ IC3.4
N$39
  Bottom 0.813: C8.- IC3.5
N$40
  Bottom 0.61: IC3.13 18.41,32.7 19.05,32.07 21.59,32.07 22.22,31.43 22.22,25.08 22.86,24.45 22.86,21.91 18.41,17.46 X4.3
N$41
  Bottom 0.61: IC3.14 15.88,32.7 17.14,31.43 17.14,25.08 16.51,24.45 16.51,19.37 17.04,18.83 X4.8
N$42
  Bottom 0.61: X4.4 15.67,9.41 17.14,7.94 25.4,7.94 27.3,9.84 27.3,17.46 31.12,21.27 SV4.1
N$43
  Bottom 1.778: B1.AC1 54.61,20.64 54.61,15.56 F1.2
N$44
  Bottom 0.813: X4.7 19.79,10.38 20.95,9.21 24.77,9.21 26.04,10.48 SV4.3
N$45
  Bottom 0.813: IC1.16 51.44,56.2 53.34,58.1 55.88,58.1 58.42,55.56 61.59,55.56 R4.1 71.12,58.74 73.66,61.28 X6.1
N$46
  Bottom 0.813: 23.49,36.51 IC3.11 23.49,39.05 SJ1.1
N$47
  Bottom 0.813: IC1.11 46.35,45.4 50.8,40.96 67.94,40.96 86.36,22.54 86.36,17.46 88.9,14.92 93.34,14.92 94.61,16.19 94.61,26.35 93.34,27.62 X7.8 88.9,27.62 87,29.53 87,33.65 83.5,37.15 RN2.4
V+
  Bottom 1.778: 47.62,18.1 48.89,18.1 | 48.89,18.1 B1.+ | IC4.IN 45.09,15.56 47.62,18.1 | 56.52,33.34 C1.+ 54.48,31.31 47.62,24.45 47.62,19.37 | 56.52,33.34 60.32,33.34 67.94,25.72 IC2.4 | 47.62,18.1 47.62,19.37 | 56.52,33.34 54.61,31.43 | 48.89,18.1 47.62,19.37

### Text on the board
Top: SimpleSwitcher V2.0 | populate | this side
Bottom: solder | this side | (C) | 2011 | EMM
tPlace: L3 | L2 | L1 | GND | T1 | T2 | T3 | T4 | T5 | T6 | T7 | T8 | T9 | T10 | ~ | ~ | Out1 | Out2